# Altium schematic sheet MCU.SchDoc
size A4; SheetNumber: 4; SheetTotal: 5
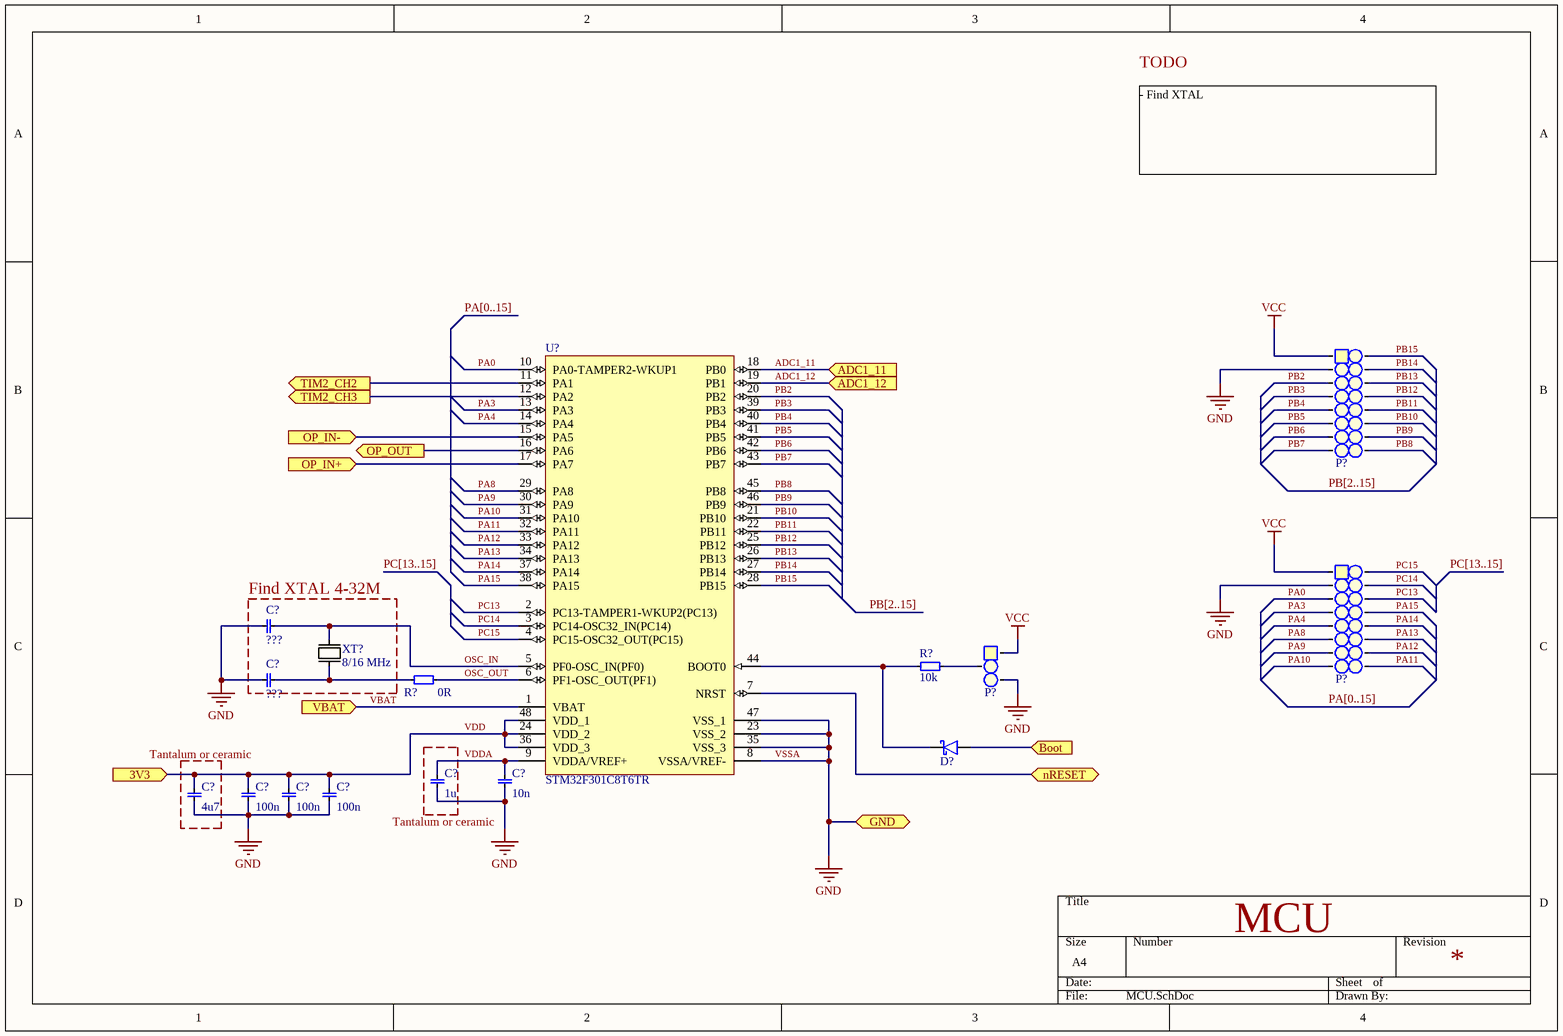
[diagram p0: MCU.SchDoc]

## Parts
(Parts that share a designator on the sheet are numbered #1, #2 ... from top to bottom, then left to right.)
C?#1  value ???  [0805, cap]  (hidden comment: 0805, capacitor)
C?#2  value ???  [0805, cap]  (hidden comment: 0805, capacitor)
C?#3  value 1u  [0805, cap]  (hidden comment: 0805, capacitor)
C?#4  value 10n  [0805, cap]  (hidden comment: 0805, capacitor)
C?#5  value 4u7  [0805, cap]  (hidden comment: 0805, capacitor)
C?#6  value 100n  [0805, cap]  (hidden comment: 0805, capacitor)
C?#7  value 100n  [0805, cap]  (hidden comment: 0805, capacitor)
C?#8  value 100n  [0805, cap]  (hidden comment: 0805, capacitor)
D?  B340A-E3/61T  [DO-214AC]  (value not drawn)
P?#1  2x8 Pin Header  [2x8 Pin Header]  (value not drawn)
P?#2  2x8 Pin Header  [2x8 Pin Header]  (value not drawn)
P?#3  1x3 Pin Header Mux  [padThree_L]  (value not drawn)
R?#1  value 10k  [0603]  (hidden comment: 0603, resistor)
R?#2  value 0R  [0603]  (hidden comment: 0603, resistor)
U?  STM32F301C8T6TR  [STM-LQFP48_N]
XT?  value 8/16 MHz  [XTAL_SMD_LP]  (hidden comment: XTAL TXC 7A)

## Blocks framed on the sheet
Find XTAL 4-32M: C?#1 C?#2 XT?

## Ports
3V3 (in), ADC1_11 (in), ADC1_12 (in), Boot (in), GND (bidir), nRESET (bidir), OP_IN+ (in), OP_IN- (in), OP_OUT (out), TIM2_CH2 (out), TIM2_CH3 (out), VBAT (in)

## Nets
VCC: P?#1.1 P?#2.1 P?#3.1
VSSA: C?#1.1 C?#2.1 C?#3.0 C?#4.0 C?#5.0 C?#6.0 C?#7.0 C?#8.0 P?#1.2 P?#2.2 P?#3.3 U?.8(VSSA/VREF-) U?.23(VSS_2) U?.35(VSS_3) U?.47(VSS_1) ; port GND  [also labelled GND]
ADC1_11: U?.18(PB0) ; port ADC1_11
ADC1_12: U?.19(PB1) ; port ADC1_12
Boot: D?.3(A) ; port Boot
nRESET: U?.7(NRST) ; port nRESET
OP_IN+: U?.17(PA7) ; port OP_IN+
OP_IN-: U?.15(PA5) ; port OP_IN-
OP_OUT: U?.16(PA6) ; port OP_OUT
OSC_IN: C?#1.0 U?.5(PF0-OSC_IN(PF0)) XT?.2
OSC_OUT: R?#2.0 U?.6(PF1-OSC_OUT(PF1))
PA0: P?#2.3 U?.10(PA0-TAMPER2-WKUP1)
PA3: P?#2.4 U?.13(PA3)
PA4: P?#2.5 U?.14(PA4)
PA8: P?#2.6 U?.29(PA8)
PA9: P?#2.7 U?.30(PA9)
PA10: P?#2.8 U?.31(PA10)
PA11: P?#2.9 U?.32(PA11)
PA12: P?#2.10 U?.33(PA12)
PA13: P?#2.11 U?.34(PA13)
PA14: P?#2.12 U?.37(PA14)
PA15: P?#2.13 U?.38(PA15)
PB2: P?#1.3 U?.20(PB2)
PB3: P?#1.4 U?.39(PB3)
PB4: P?#1.5 U?.40(PB4)
PB5: P?#1.6 U?.41(PB5)
PB6: P?#1.7 U?.42(PB6)
PB7: P?#1.8 U?.43(PB7)
PB8: P?#1.9 U?.45(PB8)
PB9: P?#1.10 U?.46(PB9)
PB10: P?#1.11 U?.21(PB10)
PB11: P?#1.12 U?.22(PB11)
PB12: P?#1.13 U?.25(PB12)
PB13: P?#1.14 U?.26(PB13)
PB14: P?#1.15 U?.27(PB14)
PB15: P?#1.16 U?.28(PB15)
PC13: P?#2.14 U?.2(PC13-TAMPER1-WKUP2(PC13))
PC14: P?#2.15 U?.3(PC14-OSC32_IN(PC14))
PC15: P?#2.16 U?.4(PC15-OSC32_OUT(PC15))
TIM2_CH2: U?.11(PA1) ; port TIM2_CH2
TIM2_CH3: U?.12(PA2) ; port TIM2_CH3
VBAT: U?.1(VBAT) ; port VBAT
VDD: C?#5.1 C?#6.1 C?#7.1 C?#8.1 U?.24(VDD_2) U?.36(VDD_3) U?.48(VDD_1) ; port 3V3
VDDA: C?#3.1 C?#4.1 U?.9(VDDA/VREF+)
NetC?#2_0: C?#2.0 R?#2.1 XT?.1
NetD?_1: D?.1(K) R?#1.1 U?.44(BOOT0)
NetP?#3_2: P?#3.2 R?#1.0

## Buses and harness runs
bus PA[0..15]
bus PB[2..15]
bus PC[13..15]

## Notes on the sheet
- TODO
- - Find XTAL
- (near C?#6) Tantalum or ceramic
- (near C?#3) Tantalum or ceramic
- MCU

## Library data of the parts
D? = B340A-E3/61T: SchottkydiodE, 40 V, 3 A; Value: Schottky Diode; Farnell: 2335183
P?#1 P?#2 = 2x8 Pin Header: 2.54 mm; Value: 1x8 Pin Header
P?#3 = 1x3 Pin Header Mux: 2.54 mm; Value: 1x3 Pin Header
U? = STM32F301C8T6TR: MCU 32-bit ARM Cortex M4 RISC 64KB Flash 2.5V/3.3V 48-Pin LQFP T/R; Supplier 1: Mouser; Supplier Part Number 1: 511-STM32F301C8T6TR
XT? = XTAL TXC 7A: 16 MHz, SMD, 5mm x 3,2mm, 30 ppm; Farnell: 1841946